# EAGLE design SOIC12-TSSOP12 v1.0 (EAGLE 7.2.0)
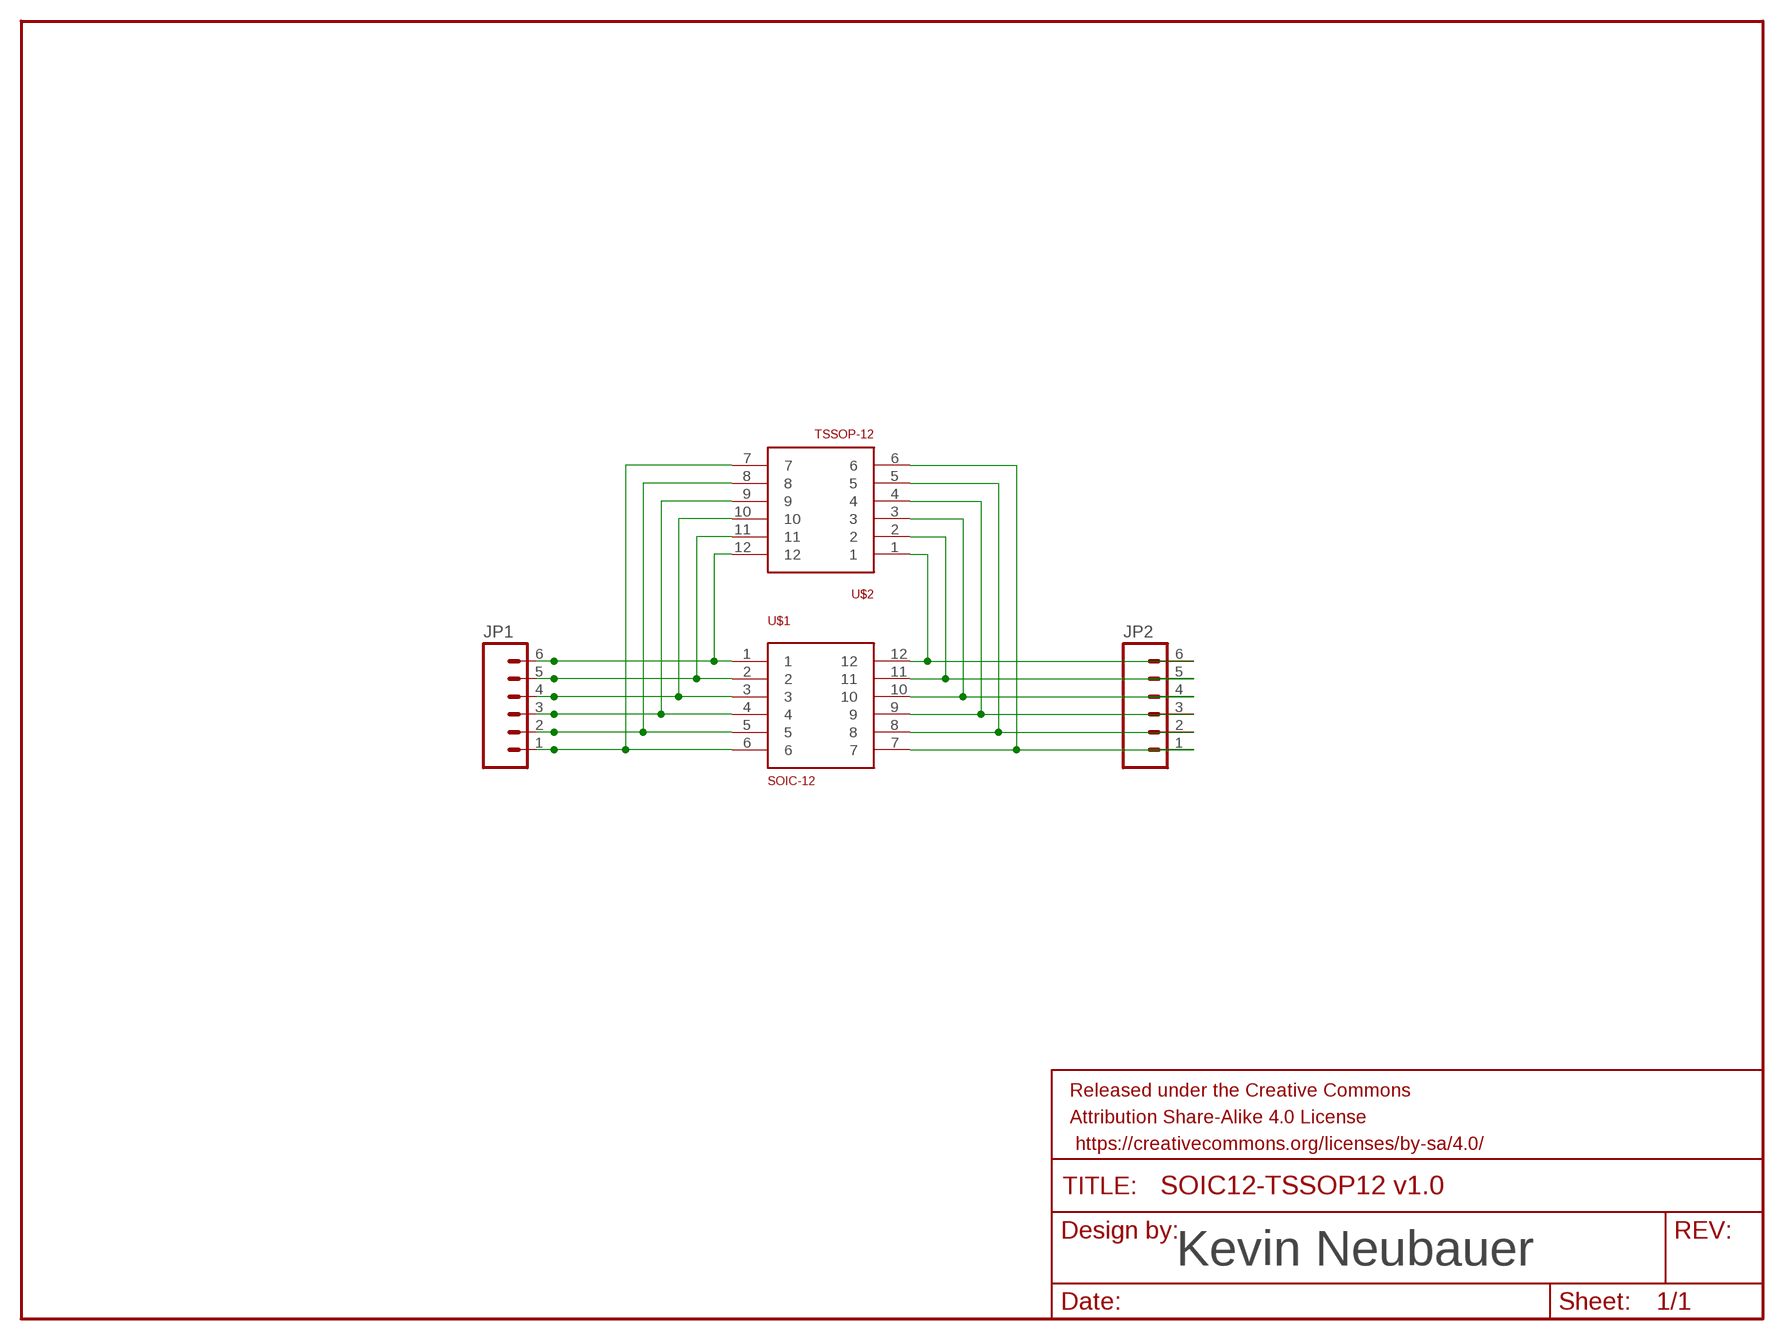
[diagram p0: schematic, sheet 1]

## Parts
FRAME1  FRAME-LETTER  [CREATIVE_COMMONS]
JP1  M06NO_SILK  [1X06_NO_SILK]
JP2  M06NO_SILK  [1X06_NO_SILK]
U$1  SOIC-12  [SOIC-12]
U$2  TSSOP-12  [TSSOP12]

## Nets
N$1: JP1.6 U$1.1 U$2.12
N$2: JP1.5 U$1.2 U$2.11
N$3: JP1.4 U$1.3 U$2.10
N$4: JP1.3 U$1.4 U$2.9
N$5: JP1.2 U$1.5 U$2.8
N$6: JP1.1 U$1.6 U$2.7
N$11: JP2.6 U$1.12 U$2.1
N$12: JP2.5 U$1.11 U$2.2
N$13: JP2.4 U$1.10 U$2.3
N$14: JP2.3 U$1.9 U$2.4
N$15: JP2.2 U$1.8 U$2.5
N$16: JP2.1 U$1.7 U$2.6

## Notes on the sheet
- Kevin Neubauer

## Library data of the parts
FRAME1 = SparkFun-Aesthetics:FRAME-LETTER: Schematic Frame Standard 8.5x11 US Letter frame
JP1 JP2 = SparkFun-Connectors:M06: Header 6 Standard 6-pin 0.1" header. Use with straight break away headers (SKU : PRT-00116), right angle break away headers (PRT-00553), swiss pins (PRT-00743), machine pins (PRT-00117), and female headers (PRT-00115). Molex polarized connector foot print use with SKU : PRT-08094 with associated crimp pins and housings. NOTES ON THE VARIANTS LOCK and LOCK_LONGPADS... This footprint was designed to help hold the alignment of a through-hole component (i.e. 6-pin header) while soldering it into place. You may notice that each hole has been shifted either up or down by 0.005 of an inch from it's more standard position (which is a perfectly straight line). This slight alteration caused the pins (the squares in the middle) to touch the edges of the holes. Because they are alternating, it causes a "brace" to hold the component in place. 0.005 has proven to be the perfect amount of "off-center" position when using our standard breakaway headers. Although looks a little odd when you look at the bare footprint, once you have a header in there, the alteration is very hard to notice. Also,if you push a header all the way into place, it is covered up entirely on the bottom side. This idea of altering the position of holes to aid alignment will be further integrated into the Sparkfun Library for other footprints. It can help hold any component with 3 or more connection pins.
U$1 = Kevin-GenericICFootprints:SOIC-12
U$2 = Kevin-GenericICFootprints:TSSOP-12

## Board
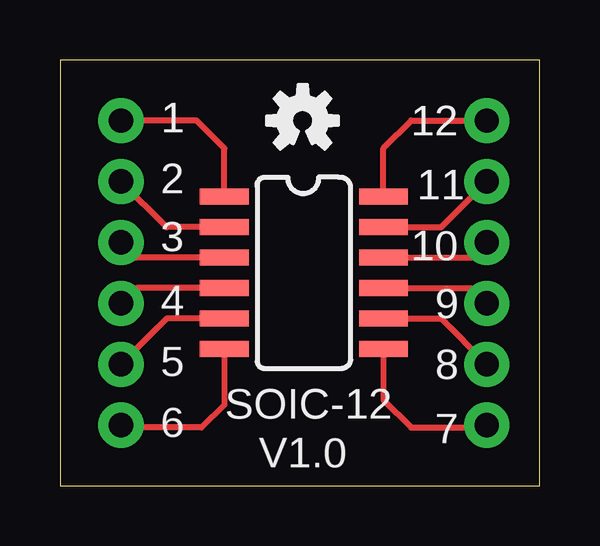
[diagram p1: board, top side]
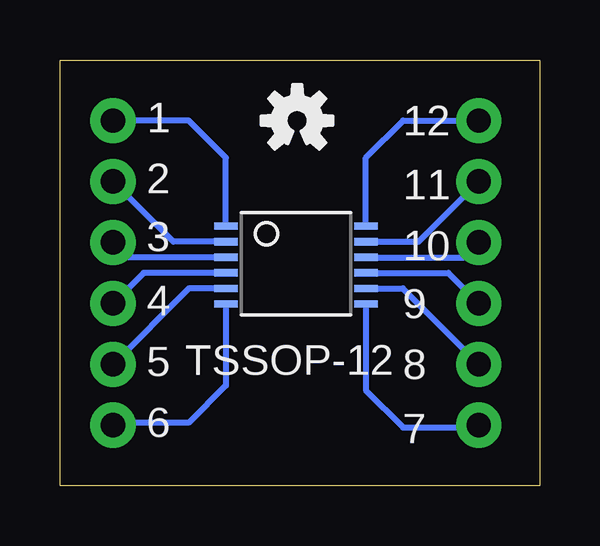
[diagram p2: board, bottom side, seen from below]

Size 19.99 x 17.77 mm. Coordinates in mm from the lower left corner, seen from the top.
Outline: 0,0 19.99,0 19.99,17.77 0,17.77 0,0
Copper layers (1*16): Top 0.035mm / dielectric 1.5mm / Bottom 0.035mm
Design rules "dirt_cheap_dirty_boards.v1": minimum track width 5mil, minimum drill 12mil, track to track 5mil, track to pad 5mil, pad to pad 5mil, via to via 5mil, smd to smd 0mil, copper to edge 10mil, drill to drill 10mil, minimum pad ring 10mil, minimum via ring 6mil, stop-mask expansion 2mil, vias tented up to drill 25mil, thermal gap 10mil

### Footprints (pad centres in the part's own frame; a part is rotated, then mirrored left to right if it is on the bottom)
1X06_NO_SILK = drill 1.016 pad 1.88: 1 0,0; 2 2.54,0; 3 5.08,0; 4 7.62,0; 5 10.16,0; 6 12.7,0
SOIC-12 = smd 0.66 x 2.032: 1 -3.175,-3.315; 2 -1.905,-3.315; 3 -0.635,-3.315; 4 0.635,-3.315; 5 1.905,-3.315; 6 3.175,-3.315; 7 3.175,3.315; 8 1.905,3.315; 9 0.635,3.315; 10 -0.635,3.315; 11 -1.905,3.315; 12 -3.175,3.315
TSSOP12 = smd 0.305 x 0.991: 1 -1.95,-2.918; 2 -1.3,-2.918; 3 -0.65,-2.918; 4 0,-2.918; 5 0.65,-2.918; 6 1.3,-2.918; 7 1.3,2.918; 8 0.65,2.918; 9 0,2.918; 10 -0.65,2.918; 11 -1.3,2.918; 12 -1.95,2.918

### Placement (x,y rotation side)
FRAME1  -9.65,-12.9 0 top  (outside the outline)
JP1  2.54,2.54 90 top
JP2  17.78,2.54 90 top
U$1  10.16,8.89 270 top
U$2  10.16,8.89 270 bottom
U$3  [OSHW-LOGO-S]  10.11,15.24 0 top
U$4  [OSHW-LOGO-S]  10.11,15.24 0 bottom

### Tracks (layer width: path | path; a pad name or v marks a point on that pad's centre or on a via)
N$1
  Top 0.254: U$1.1 6.84,14.08 5.69,15.24 JP1.6
  Bottom 0.254: U$2.12 7.24,13.69 5.69,15.24 JP1.6
N$2
  Top 0.254: U$1.2 4.45,10.79 JP1.5
  Bottom 0.254: U$2.11 5.05,10.19 JP1.5
N$3
  Top 0.254: U$1.3 3.17,9.52 JP1.4
  Bottom 0.254: U$2.10 3.16,9.54 JP1.4
N$4
  Top 0.254: U$1.4 3.17,8.25 JP1.3
  Bottom 0.254: U$2.9 3.81,8.89 JP1.3
N$5
  Top 0.254: U$1.5 4.45,6.98 JP1.2
  Bottom 0.254: U$2.8 5.7,8.24 JP1.2
N$6
  Top 0.254: U$1.6 6.84,3.39 5.89,2.44 2.64,2.44
  Top 0.406: 2.64,2.44 JP1.1
  Bottom 0.254: U$2.7 7.24,3.99 5.69,2.44 2.64,2.44 JP1.1
N$11
  Top 0.254: U$1.12 13.47,14.08 14.63,15.24 JP2.6
  Bottom 0.254: U$2.1 13.08,13.69 14.63,15.24 JP2.6
N$12
  Top 0.254: U$1.11 15.88,10.79 JP2.5
  Bottom 0.254: U$2.2 15.27,10.19 JP2.5
N$13
  Top 0.254: U$1.10 17.14,9.52 JP2.4
  Bottom 0.254: U$2.3 17.16,9.54 JP2.4
N$14
  Top 0.254: U$1.9 17.14,8.25 JP2.3
  Bottom 0.254: U$2.4 16.51,8.89 JP2.3
N$15
  Top 0.254: U$1.8 15.88,6.98 JP2.2
  Bottom 0.254: U$2.5 14.62,8.24 JP2.2
N$16
  Top 0.254: U$1.7 13.47,3.59 14.63,2.44 17.68,2.44
  Top 0.406: 17.68,2.44 JP2.1
  Bottom 0.254: U$2.6 13.08,4.19 14.63,2.64 17.68,2.64
  Bottom 0.406: 17.68,2.64 JP2.1

### Text on the board
tPlace: 1 | 12 | 2 | 11 | 3 | 10 | 4 | 9 | 5 | 8 | SOIC-12 | 6 | 7 | V1.0
bPlace: 12 | 1 | 11 | 2 | 10 | 3 | 9 | 4 | 8 | TSSOP-12 | 5 | 7 | 6
tDocu: Kevin Neubauer